# EAGLE design Gonies (EAGLE 9.6.2)
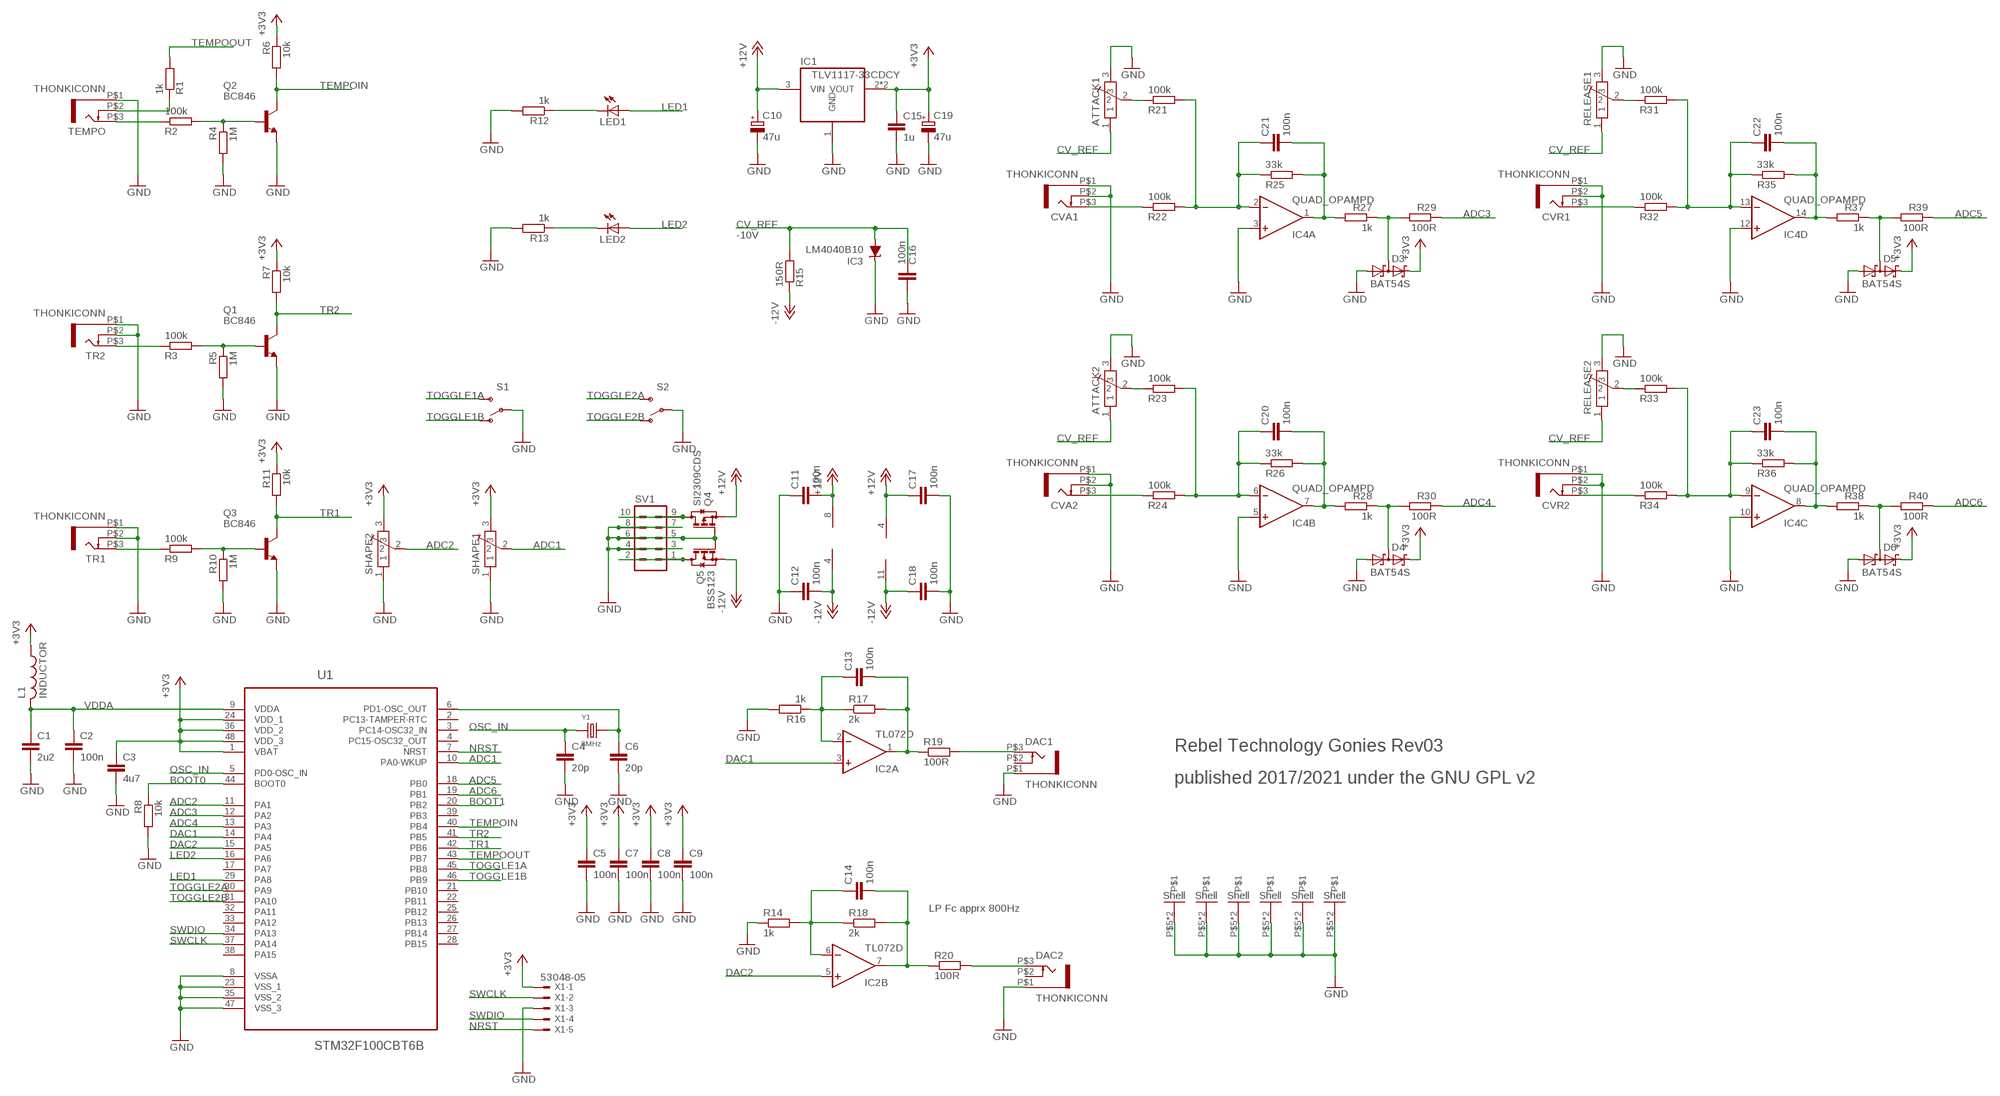
[diagram p0: schematic, sheet 1]

## Parts
ATTACK1  POT-ALPS-RK09L1140  [POT-ALPS-RK09L1140]
ATTACK2  POT-ALPS-RK09L1140  [POT-ALPS-RK09L1140]
C1  2u2  C-EUC0603  [C0603]
C2  100n  C-EUC0603  [C0603]
C3  4u7  C-EUC0603  [C0603]
C4  20p  C-EUC0603  [C0603]
C5  100n  C-EUC0603  [C0603]
C6  20p  C-EUC0603  [C0603]
C7  100n  C-EUC0603  [C0603]
C8  100n  C-EUC0603  [C0603]
C9  100n  C-EUC0603  [C0603]
C10  47u  CPOL-EU153CLV-0505  [CPOL-5]
C11  100n  C-EUC0603  [C0603]
C12  100n  C-EUC0603  [C0603]
C13  100n  C-EUC0603  [C0603]
C14  100n  C-EUC0603  [C0603]
C15  1u  C-EUC0603  [C0603]
C16  100n  C-EUC0603  [C0603]
C17  100n  C-EUC0603  [C0603]
C18  100n  C-EUC0603  [C0603]
C19  47u  CPOL-EU153CLV-0505  [CPOL-5]
C20  100n  C-EUC0603  [C0603]
C21  100n  C-EUC0603  [C0603]
C22  100n  C-EUC0603  [C0603]
C23  100n  C-EUC0603  [C0603]
CVA1  THONKICONN  [THONKICONN]
CVA2  THONKICONN  [THONKICONN]
CVR1  THONKICONN  [THONKICONN]
CVR2  THONKICONN  [THONKICONN]
D3  BAT54S  [SOT23]
D4  BAT54S  [SOT23]
D5  BAT54S  [SOT23]
D6  BAT54S  [SOT23]
DAC1  THONKICONN  [THONKICONN]
DAC2  THONKICONN  [THONKICONN]
IC1  TLV1117-33CDCY  REG1117  [SOT223]
IC2  TL072D  [SO08]
IC3  LM4040B10  LM4041C12DBZ  [DBZ_R-PDSO-G3]
IC4  QUAD_OPAMPD  [SO14]
L1  INDUCTOR  [0603]
LED1  LED3MM  [LED3MM]
LED2  LED3MM  [LED3MM]
Q1  BC846  [SOT23]
Q2  BC846  [SOT23]
Q3  BC846  [SOT23]
Q4  SI2309CDS  BSS84  [SOT23]
Q5  BSS123  [SOT23]
R1  1k  R-EU_0603  [0603]
R2  100k  R-EU_0603  [0603]
R3  100k  R-EU_0603  [0603]
R4  1M  R-EU_0603  [0603]
R5  1M  R-EU_0603  [0603]
R6  10k  R-EU_0603  [0603]
R7  10k  R-EU_0603  [0603]
R8  10k  R-EU_0603  [0603]
R9  100k  R-EU_0603  [0603]
R10  1M  R-EU_0603  [0603]
R11  10k  R-EU_0603  [0603]
R12  1k  R-EU_0603  [0603]
R13  1k  R-EU_0603  [0603]
R14  1k  R-EU_0603  [0603]
R15  150R  R-EU_0603  [0603]
R16  1k  R-EU_0603  [0603]
R17  2k  R-EU_0603  [0603]
R18  2k  R-EU_0603  [0603]
R19  100R  R-EU_0603  [0603]
R20  100R  R-EU_0603  [0603]
R21  100k  R-EU_0603  [0603]
R22  100k  R-EU_0603  [0603]
R23  100k  R-EU_0603  [0603]
R24  100k  R-EU_0603  [0603]
R25  33k  R-EU_0603  [0603]
R26  33k  R-EU_0603  [0603]
R27  1k  R-EU_0603  [0603]
R28  1k  R-EU_0603  [0603]
R29  100R  R-EU_0603  [0603]
R30  100R  R-EU_0603  [0603]
R31  100k  R-EU_0603  [0603]
R32  100k  R-EU_0603  [0603]
R33  100k  R-EU_0603  [0603]
R34  100k  R-EU_0603  [0603]
R35  33k  R-EU_0603  [0603]
R36  33k  R-EU_0603  [0603]
R37  1k  R-EU_0603  [0603]
R38  1k  R-EU_0603  [0603]
R39  100R  R-EU_0603  [0603]
R40  100R  R-EU_0603  [0603]
RELEASE1  POT-ALPS-RK09L1140  [POT-ALPS-RK09L1140]
RELEASE2  POT-ALPS-RK09L1140  [POT-ALPS-RK09L1140]
S1  SWITCH-SPST  [SWITCH-SPDT-SALECOM-T8014]
S2  SWITCH-SPST  [SWITCH-SPDT-SALECOM-T8014]
SHAPE1  POT-ALPS-RK09L1140  [POT-ALPS-RK09L1140]
SHAPE2  POT-ALPS-RK09L1140  [POT-ALPS-RK09L1140]
SV1  MA05-2  [MA05-2]
TEMPO  THONKICONN  [THONKICONN]
TR1  THONKICONN  [THONKICONN]
TR2  THONKICONN  [THONKICONN]
U1  STM32F100CBT6B  [QFP50P900X900X160-48N]
X1  53048-05  [53048-05]
Y1  8MHz  SMD-CRYSTAL-8MHZ-20PF-20PPM(2P-5.0X3.2MM)  [X2-SMD-5.0X3.2X1.3MM]

## Nets
+3V3: C3.1 C5.1 C7.1 C8.1 C9.1 C15.1 C19.+ D3.2(C2) D4.2(C2) D5.2(C2) D6.2(C2) IC1.2(VOUT) IC1.4(VOUT) L1.1 R6.1 R7.1 R11.1 SHAPE1.3 SHAPE2.3 U1.1(VBAT) U1.24(VDD_1) U1.36(VDD_2) U1.48(VDD_3) X1.1
+12V: C10.+ C11.2 C17.1 IC1.3(VIN) IC2.8(P:V+) IC4.4(P:V+) Q4.2(S)
-12V: C12.2 C18.1 IC2.4(P:V-) IC4.11(P:V-) Q5.2(S) R15.1
ADC1: SHAPE1.2 U1.10(PA0-WKUP)
ADC2: SHAPE2.2 U1.11(PA1)
ADC3: R29.1 U1.12(PA2)
ADC4: R30.1 U1.13(PA3)
ADC5: R39.1 U1.18(PB0)
ADC6: R40.1 U1.19(PB1)
BOOT0: R8.1 U1.44(BOOT0)
BOOT1: U1.20(PB2)
CV_REF: ATTACK1.1 ATTACK2.1 C16.1 IC3.2(A) R15.2 RELEASE1.1 RELEASE2.1
DAC1: IC2.3(A:+IN) U1.14(PA4)
DAC2: IC2.5(B:+IN) U1.15(PA5)
GND: ATTACK1.3 ATTACK1.P$5 ATTACK1.P$6 ATTACK2.3 ATTACK2.P$5 ATTACK2.P$6 C1.2 C2.2 C3.2 C4.2 C5.2 C6.2 C7.2 C8.2 C9.2 C10.- C11.1 C12.1 C15.2 C16.2 C17.2 C18.2 C19.- CVA1.P$1 CVA1.P$2 CVA2.P$1 CVA2.P$2 CVR1.P$1 CVR1.P$2 CVR2.P$1 CVR2.P$2 D3.1(A1) D4.1(A1) D5.1(A1) D6.1(A1) DAC1.P$1 DAC2.P$1 IC1.1(GND) IC3.1(C) IC4.3(A:+IN) IC4.5(B:+IN) IC4.10(C:+IN) IC4.12(D:+IN) Q1.2(E) Q2.2(E) Q3.2(E) Q4.1(G) Q5.1(G) R4.2 R5.2 R8.2 R10.2 R12.2 R13.2 R14.1 R16.2 RELEASE1.3 RELEASE1.P$5 RELEASE1.P$6 RELEASE2.3 RELEASE2.P$5 RELEASE2.P$6 S1.2(P) S2.2(P) SHAPE1.1 SHAPE1.P$5 SHAPE1.P$6 SHAPE2.1 SHAPE2.P$5 SHAPE2.P$6 SV1.3 SV1.4 SV1.5 SV1.6 SV1.7 SV1.8 TEMPO.P$1 TR1.P$1 TR1.P$2 TR2.P$1 TR2.P$2 U1.8(VSSA) U1.23(VSS_1) U1.35(VSS_2) U1.47(VSS_3) X1.3
LED1: LED1.A U1.29(PA8)
LED2: LED2.A U1.16(PA6)
N$1: C6.1 U1.6(PD1-OSC_OUT) Y1.2
N$2: LED2.K(C) R13.1
N$3: C14.2 IC2.7(B:OUT) R18.2 R20.1
N$4: C14.1 IC2.6(B:-IN) R14.2 R18.1
N$6: Q4.3(D) SV1.9 SV1.10
N$7: C13.2 IC2.1(A:OUT) R17.2 R19.1
N$9: LED1.K(C) R12.1
N$10: Q1.1(B) R3.2 R5.1
N$11: Q2.1(B) R2.2 R4.1
N$12: R2.1 TEMPO.P$3
N$13: C13.1 IC2.2(A:-IN) R16.1 R17.1
N$14: R3.1 TR2.P$3
N$16: Q5.3(D) SV1.1 SV1.2
N$17: R1.1 TEMPO.P$2
N$19: CVA1.P$3 R22.1
N$20: C21.1 IC4.2(A:-IN) R21.2 R22.2 R25.1
N$21: ATTACK1.2 R21.1
N$22: C21.2 IC4.1(A:OUT) R25.2 R27.2
N$23: R9.1 TR1.P$3
N$24: D3.3(C1A2) R27.1 R29.2
N$25: CVA2.P$3 R24.1
N$26: C20.1 IC4.6(B:-IN) R23.2 R24.2 R26.1
N$27: Q3.1(B) R9.2 R10.1
N$28: ATTACK2.2 R23.1
N$30: C20.2 IC4.7(B:OUT) R26.2 R28.2
N$31: DAC1.P$3 R19.2
N$32: DAC2.P$3 R20.2
N$33: D4.3(C1A2) R28.1 R30.2
N$35: CVR1.P$3 R32.1
N$36: C22.1 IC4.13(D:-IN) R31.2 R32.2 R35.1
N$37: R31.1 RELEASE1.2
N$39: C22.2 IC4.14(D:OUT) R35.2 R37.2
N$40: D5.3(C1A2) R37.1 R39.2
N$41: CVR2.P$3 R34.1
N$42: C23.1 IC4.9(C:-IN) R33.2 R34.2 R36.1
N$43: R33.1 RELEASE2.2
N$44: C23.2 IC4.8(C:OUT) R36.2 R38.2
N$45: D6.3(C1A2) R38.1 R40.2
NRST: U1.7(NRST) X1.5
OSC_IN: C4.1 U1.5(PD0-OSC_IN) Y1.1
SWCLK: U1.37(PA14) X1.2
SWDIO: U1.34(PA13) X1.4
TEMPOIN: Q2.3(C) R6.2 U1.40(PB4)
TEMPOOUT: R1.2 U1.43(PB7)
TOGGLE1A: S1.3(S) U1.45(PB8)
TOGGLE1B: S1.1(O) U1.46(PB9)
TOGGLE2A: S2.3(S) U1.30(PA9)
TOGGLE2B: S2.1(O) U1.31(PA10)
TR1: Q3.3(C) R11.2 U1.42(PB6)
TR2: Q1.3(C) R7.2 U1.41(PB5)
VDDA: C1.1 C2.1 L1.2 U1.9(VDDA)
Unconnected: DAC1.P$2 DAC2.P$2 U1.2(PC13-TAMPER-RTC) U1.3(PC14-OSC32_IN) U1.4(PC15-OSC32_OUT) U1.17(PA7) U1.21(PB10) U1.22(PB11) U1.25(PB12) U1.26(PB13) U1.27(PB14) U1.28(PB15) U1.32(PA11) U1.33(PA12) U1.38(PA15) U1.39(PB3)

## Notes on the sheet
- -10V
- Rebel Technology Gonies Rev03
- published 2017/2021 under the GNU GPL v2
- LP Fc apprx 800Hz

## Library data of the parts
ATTACK1 ATTACK2 RELEASE1 RELEASE2 SHAPE1 SHAPE2 = Rebel:POT-ALPS-RK09L
C1-C9 C11-C18 C20-C23 = Rebel:C-EU: CAPACITOR, European symbol
C10 C19 = Rebel:CPOL-EU: POLARIZED CAPACITOR, European symbol; FARNELL: 882-3014
CVA1 CVA2 CVR1 CVR2 DAC1 DAC2 TEMPO TR1 TR2 = Rebel:THONKICONN
D3-D6 = diode:BAT54S: Schottky Diodes Pin connection corrected 2011-05-04 Source: Fairchild .. BAT54.pdf
IC1 = burr-brown:REG1117: 800mA and 1A Low Dropout (LDO) Positive Regulator 1.8V, 2.5V, 2.85V, 3.3V, 5V, and Adj; FARNELL: 149-4942; MPN: REG1117; OC_FARNELL: 1097566; OC_NEWARK: 14P6981
IC2 = linear:TL072: OP AMP
IC3 = texas:LM4041: PRECISION MICROPOWER SHUNT VOLTAGE REFERENCE Source: http://focus.ti.com/lit/ds/slcs146e/slcs146e.pdf; MF: TEXAS INSTRUMENT CONNECTORS; MPN: LM4041C12QDBZT; OC_FARNELL: 1771733; OC_NEWARK: 43K3376
IC4 = adafruit:QUAD_OPAMP: OP AMP Standard quad package
L1 = Rebel:INDUCTOR
LED1 LED2 = Rebel:LED: LED
Q1-Q3 = transistor:BC846: NPN TRANSISTOR
Q4 = transistor-small-signal:BSS84: P-CHANNEL MOS FET; OC_FARNELL: 1779264
Q5 = transistor-small-signal:BSS123: N-CHANNEL MOS FET; OC_FARNELL: 1843725
R1-R40 = Rebel:R-EU_: RESISTOR, European symbol
S1 S2 = Rebel:SWITCH-SPST: SPST Switch Simple slide switch. Spark Fun Electronics SKU : COM-00102
SV1 = con-lstb:MA05-2: PIN HEADER; OC_FARNELL: unknown; OC_NEWARK: unknown
U1 = Rebel:STM32F100CBT6B: ARM-based 32-bit MCU; MPN: STM32F100CBT6B; OC_FARNELL: 1838512; OC_NEWARK: 86R1308; PACKAGE: LQFP-48; SUPPLIER: STMircroelectronics
X1 = con-molex:53?-05: CONNECTOR wire to board 1.25 mm (.049 inch) pitch header; MF: MOLEX; MPN: 53048-0510; OC_FARNELL: 9732926; OC_NEWARK: 57H4722
Y1 = Seeed-OPL-crystal-osctllator:SMD-CRYSTAL-8MHZ-20PF-20PPM(2P-5.0X3.2MM): 306010004; MPN: 5032/2P; VALUE: 5032/2p

## Board
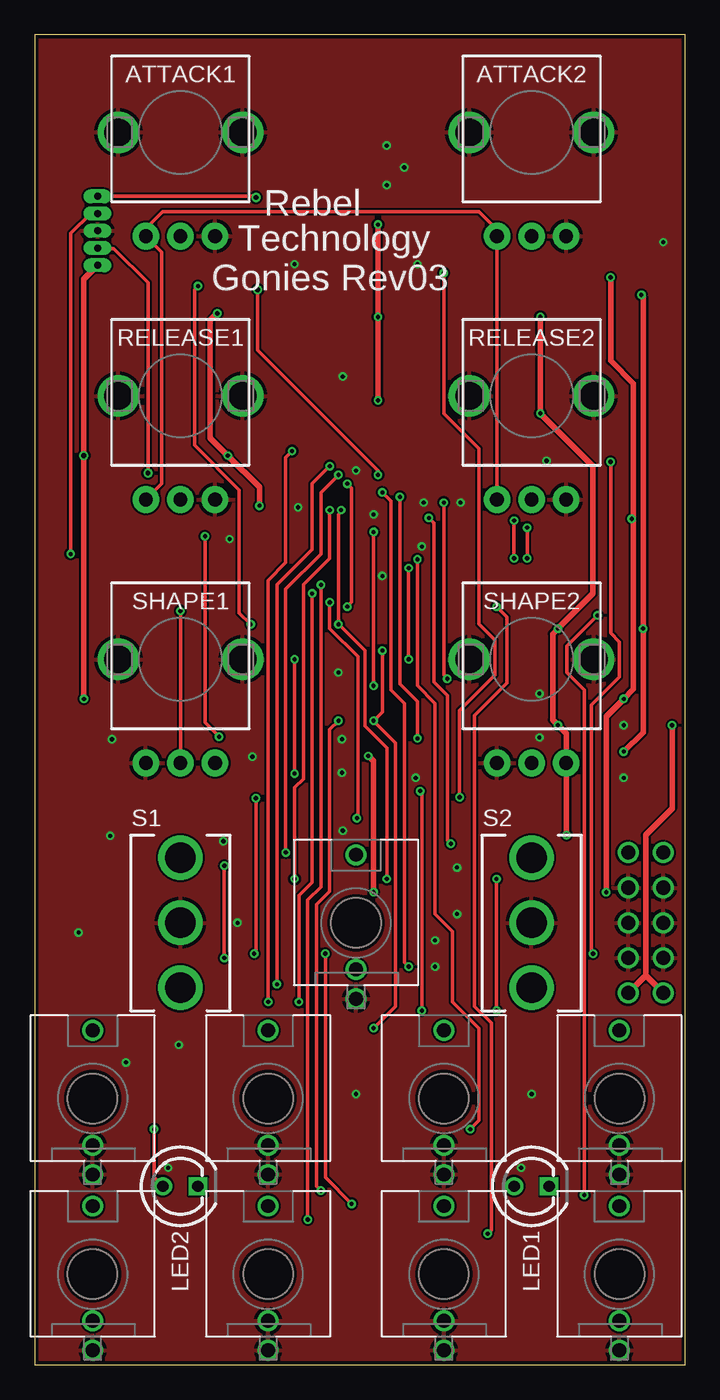
[diagram p1: board, top side]
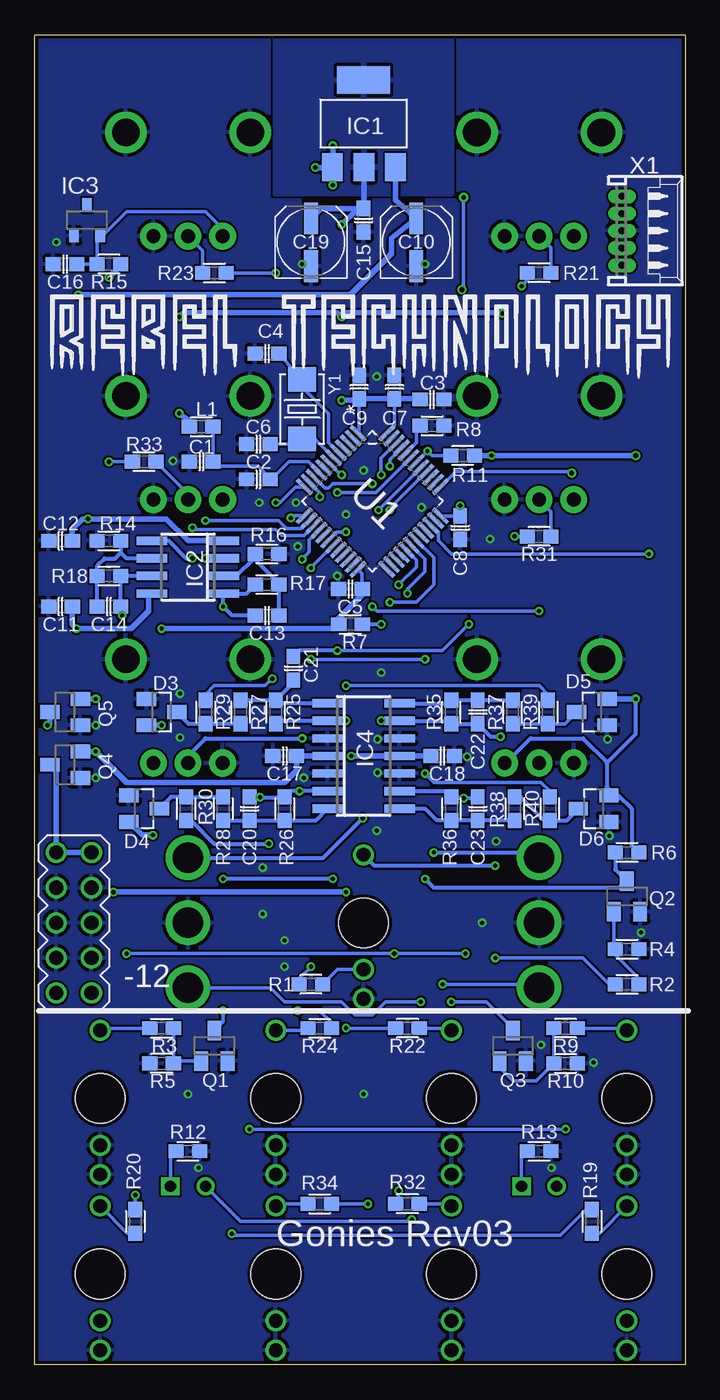
[diagram p2: board, bottom side, seen from below]

Size 47.05 x 96.19 mm. Coordinates in mm from the lower left corner, seen from the top.
Outline: 47.05,0 47.05,96.19 0,96.19 0,0 47.05,0
Copper layers (1*16): Top 0.035mm / dielectric 1.5mm / Bottom 0.035mm
Design rules "SeeedStudio_2layer_DRU_no_angle_20140221": minimum track width 6mil, minimum drill 12mil, track to track 6mil, track to pad 6mil, pad to pad 6mil, via to via 6mil, smd to smd 0mil, copper to edge 10mil, drill to drill 10mil, minimum pad ring 10mil, minimum via ring 6mil, stop-mask expansion 2mil, vias tented up to drill 100mil, thermal gap 10mil

### Footprints (pad centres in the part's own frame; a part is rotated, then mirrored left to right if it is on the bottom)
POT-ALPS-RK09L1140 = drill 1 pad 1.93: 1 -2.5,-7.5; 2 0,-7.5; 3 2.5,-7.5 | drill 2: P$5 -4.5,0; P$6 4.5,0
C0603 = smd 1.1 x 1: 1 -0.85,0; 2 0.85,0
CPOL-5 = smd 2.3 x 1: + 1.725,0; - -1.725,0
THONKICONN = drill 1: P$1 0,-5.5; P$2 0,-3.38; P$3 0,4.92 | hole 3.6: 0,0
SOT23 = smd 1 x 1.4: 1 -0.95,-1.1; 2 0.95,-1.1; 3 0,1.1
SOT223 = smd 1.499 x 2.007: 1 -2.261,-3.15; 2 0.025,-3.15; 3 2.311,-3.15 | smd 3.81 x 2.007: 4 0,3.15
SO08 = smd 0.6 x 2.2: 1 -1.905,-2.6; 2 -0.635,-2.6; 3 0.635,-2.6; 4 1.905,-2.6; 5 1.905,2.6; 6 0.635,2.6; 7 -0.635,2.6; 8 -1.905,2.6
DBZ_R-PDSO-G3 = smd 0.7 x 1: 1 -0.95,-1.1; 2 0.95,-1.1; 3 0,1.1
SO14 = smd 0.6 x 2.2: 1 -3.81,-2.6; 2 -2.54,-2.6; 3 -1.27,-2.6; 4 0,-2.6; 5 1.27,-2.6; 6 2.54,-2.6; 7 3.81,-2.6; 8 3.81,2.6; 9 2.54,2.6; 10 1.27,2.6; 11 0,2.6; 12 -1.27,2.6; 13 -2.54,2.6; 14 -3.81,2.6
0603 = smd 1.1 x 1: 1 -0.85,0; 2 0.85,0
LED3MM = drill 0.813: A -1.27,0 | drill 0.813 square: K 1.27,0
SWITCH-SPDT-SALECOM-T8014 = drill 2.2: 1 0,4.699; 2 0,0; 3 0,-4.699
MA05-2 = drill 1.016: 1 -5.08,-1.27; 2 -5.08,1.27; 3 -2.54,-1.27; 4 -2.54,1.27; 5 0,-1.27; 6 0,1.27; 7 2.54,-1.27; 8 2.54,1.27; 9 5.08,-1.27; 10 5.08,1.27
QFP50P900X900X160-48N = smd 1.473 x 0.279: 1 -4.216,2.743; 2 -4.216,2.261; 3 -4.216,1.753; 4 -4.216,1.245; 5 -4.216,0.762; 6 -4.216,0.254; 7 -4.216,-0.254; 8 -4.216,-0.762; 9 -4.216,-1.245; 10 -4.216,-1.753; 11 -4.216,-2.261; 12 -4.216,-2.743; 25 4.216,-2.743; 26 4.216,-2.261; 27 4.216,-1.753; 28 4.216,-1.245; 29 4.216,-0.762; 30 4.216,-0.254; 31 4.216,0.254; 32 4.216,0.762; 33 4.216,1.245; 34 4.216,1.753; 35 4.216,2.261; 36 4.216,2.743 | smd 0.279 x 1.473: 13 -2.743,-4.216; 14 -2.261,-4.216; 15 -1.753,-4.216; 16 -1.245,-4.216; 17 -0.762,-4.216; 18 -0.254,-4.216; 19 0.254,-4.216; 20 0.762,-4.216; 21 1.245,-4.216; 22 1.753,-4.216; 23 2.261,-4.216; 24 2.743,-4.216; 37 2.743,4.216; 38 2.261,4.216; 39 1.753,4.216; 40 1.245,4.216; 41 0.762,4.216; 42 0.254,4.216; 43 -0.254,4.216; 44 -0.762,4.216; 45 -1.245,4.216; 46 -1.753,4.216; 47 -2.261,4.216; 48 -2.743,4.216
53048-05 = drill 0.5 pad 0.698 long: 1 2.5,-1.25; 2 1.25,-1.25; 3 0,-1.25; 4 -1.25,-1.25; 5 -2.5,-1.25
X2-SMD-5.0X3.2X1.3MM = smd 1.778 x 2.032: 1 -2.159,0; 2 2.159,0

### Placement (x,y rotation side)
ATTACK1  10.55,89.12 0 top
ATTACK2  35.95,89.12 0 top
C1  35,65.3 180 bottom
C2  30.87,64.03 180 bottom
C3  18.3,69.81 0 bottom
C4  30.23,73.11 180 bottom
C5  24.2,56.1 180 bottom
C6  30.87,66.57 180 bottom
C7  21.03,70.7 90 bottom
C8  16.27,60.54 270 bottom
C9  23.57,70.7 90 bottom
C10  19.44,81.18 90 bottom
C11  45.16,54.83 0 bottom
C12  45.16,59.59 0 bottom
C13  30.23,54.19 180 bottom
C14  41.66,54.83 0 bottom
C15  23.25,82.77 270 bottom
C16  44.84,79.59 180 bottom
C17  28.96,44.03 180 bottom
C18  17.54,44.03 0 bottom
C19  27.06,81.18 90 bottom
C20  31.51,40.22 270 bottom
C21  28.33,50.38 270 bottom
C22  14.99,47.21 90 bottom
C23  14.99,40.22 270 bottom
CVA1  16.9,19.27 0 top
CVA2  29.6,19.27 0 top
CVR1  16.9,6.57 0 top
CVR2  29.6,6.57 0 top
D3  37.86,47.21 270 bottom
D4  39.12,40.22 270 bottom
D5  6.74,47.21 90 bottom
D6  6.61,40.22 90 bottom
DAC1  4.2,6.57 0 top
DAC2  42.3,6.57 0 top
IC1  23.25,89.75 0 bottom
IC2  35.95,57.68 90 bottom
IC3  43.25,82.77 0 bottom
IC4  23.25,44.03 270 bottom
L1  35,67.84 0 bottom
LED1  35.95,12.92 0 top
LED2  10.55,12.92 0 top
Q1  34.05,23.08 0 bottom
Q2  4.2,33.87 0 bottom
Q3  12.46,23.08 0 bottom
Q4  44.84,43.4 90 bottom
Q5  44.84,47.21 90 bottom
R1  27.06,27.52 180 bottom
R2  4.2,27.52 0 bottom
R3  37.86,24.35 0 bottom
R4  4.2,30.06 0 bottom
R5  37.86,21.81 180 bottom
R6  4.2,37.05 180 bottom
R7  24.2,53.56 0 bottom
R8  18.3,67.91 0 bottom
R9  8.64,24.35 180 bottom
R10  8.64,21.81 0 bottom
R11  16.07,65.75 180 bottom
R12  35.95,15.46 0 bottom
R13  10.55,15.46 0 bottom
R14  41.66,59.59 0 bottom
R15  41.66,79.59 180 bottom
R16  30.23,58.64 0 bottom
R17  30.23,56.41 180 bottom
R18  41.66,57.05 0 bottom
R19  6.74,10.38 270 bottom
R20  39.76,10.38 270 bottom
R21  10.55,78.96 180 bottom
R22  20.08,24.35 180 bottom
R23  34.05,78.96 0 bottom
R24  26.43,24.35 0 bottom
R25  29.6,47.21 90 bottom
R26  28.96,40.22 270 bottom
R27  32.14,47.21 90 bottom
R28  33.41,40.22 270 bottom
R29  34.68,47.21 270 bottom
R30  36.08,40.22 90 bottom
R31  10.55,59.91 180 bottom
R32  20.08,11.65 180 bottom
R33  39.12,65.3 180 bottom
R34  26.43,11.65 0 bottom
R35  16.9,47.21 90 bottom
R36  16.9,40.22 270 bottom
R37  12.46,47.21 90 bottom
R38  12.33,40.22 270 bottom
R39  9.91,47.21 270 bottom
R40  9.79,40.22 270 bottom
RELEASE1  10.55,70.07 0 top
RELEASE2  35.95,70.07 0 top
S1  10.55,31.97 0 top
S2  35.95,31.97 0 top
SHAPE1  10.55,51.02 0 top
SHAPE2  35.95,51.02 0 top
SV1  44.2,31.97 90 bottom
TEMPO  23.25,31.97 0 top
TR1  4.2,19.27 0 top
TR2  42.3,19.27 0 top
U1  22.62,62.45 315 bottom
X1  3.31,82 270 bottom
Y1  27.7,69.11 270 bottom

### Tracks (layer width: path | path; a pad name or v marks a point on that pad's centre or on a via)
+3V3  (via drill 0.3, 0.35)
  Top 0.406: v24.84,69.75 v24.84,75.78 v24.84,82.45 | v36.59,75.78 v36.59,68.8 40.4,64.99 40.4,55.78 v37.86,53.24 37.47,52.86 37.47,46.63 v37.86,46.25 38.45,45.66 SHAPE2.3 38.45,38.36 v38.49,38.32 | v3.56,48.16 v3.56,65.75 3.56,78.51 X1.1 | v13.22,76.03 12.71,75.53 12.71,67.02 v13.98,65.75 16.27,63.46 v16.27,62.13
  Bottom 0.254: C9.1 23.57,67.46 U1.1 | C7.1 21.03,67.91 U1.48 | C5.1 23.35,57.22 U1.24 | C8.1 17.68,61.39 U1.36
  Bottom 0.305: SHAPE1.3 12.97,43.52 11.19,45.3 7.38,45.3 5.63,43.55 | R6.1 3.86,37.55 3.86,40.22 4.81,41.17 | 5.63,43.55 5.66,43.52 5.66,41.8 4.81,40.95 4.81,41.17 | 5.63,43.55 3.56,45.62 v3.56,48.16 | D6.2 4.81,41.17
  Bottom 0.406: IC1.2 23.23,83.96 C15.1 | C19.+ 26.35,83.62 C15.1 | C3.1 19.19,69.85 C7.1 C9.1 23.67,69.75 v24.84,69.75 | v24.84,82.45 23.67,83.62 C15.1 | v36.59,75.78 36.27,76.1 25.16,76.1 v24.84,75.78 24.52,76.1 13.28,76.1 v13.22,76.03 | v37.86,53.24 25.47,53.24 25.16,53.56 | v37.86,46.25 D3.2 | C5.1 23.35,55.68 25.16,53.87 25.16,53.56 | v38.49,38.32 39.27,38.32 D4.2 | L1.1 35.85,68.26 v36.59,68.8 | R7.1 25.16,53.56 | v16.27,62.13 C8.1 | R11.1 v13.98,65.75 v3.56,65.75 | v3.56,48.16 D5.2
  pour Bottom: 16.9,96.1 16.9,84.67 29.6,84.67 29.6,96.1
+12V  (via drill 0.3)
  Top 0.406: v42.62,44.35 44.01,45.75 v44.01,53.24 44.01,77.24 v43.89,77.37
  Bottom 0.254: IC2.8 38.81,55.78
  Bottom 0.406: IC1.3 20.94,84.22 C10.+ 21.22,81.45 21.22,80.35 24.2,77.37 v43.89,77.37 | 38.81,55.78 38.81,54.51 40.08,53.24 v44.01,53.24 44.31,53.53 C11.2 | IC4.4 C17.1 28.12,42.98 28.96,42.13 40.4,42.13 v42.62,44.35 Q4.2
-12V  (via drill 0.3)
  Top 0.406: v24.14,44.03 24.52,43.65 v24.52,34.19 | v41.35,34.19 41.35,46.89 v42.62,48.16 43.32,48.86 43.32,61.05 v43.19,61.18 43.32,61.3 43.32,70.95 41.66,72.61 v41.66,78.64
  Bottom 0.305: Q5.2 43.25,48.16
  Bottom 0.406: C18.1 IC4.11 v24.14,44.03 | v24.52,34.19 v41.35,34.19 | IC2.4 35.95,59.59 37.54,61.18 v43.19,61.18 43.57,61.18 44.31,60.44 C12.2 | R15.1 40.82,79.49 v41.66,78.64 | 43.25,48.16 v42.62,48.16
ADC1  (via drill 0.3)
  Top 0.254: SHAPE1.2 v10.55,54.51 | v22.62,54.83 22.93,55.14 22.93,63.4 v22.62,63.72
  Bottom 0.254: v10.55,54.51 22.3,54.51 v22.62,54.83 | v22.62,63.72 25.47,63.72 25.79,63.4 26.05,63.4 U1.10
ADC2  (via drill 0.3)
  Top 0.254: v26.43,62.76 26.43,49.23 27.7,47.96 v27.7,45.3
  Bottom 0.254: v26.43,62.76 26.45,63.08 U1.11 | SHAPE2.2 35.95,44.03
  Bottom 0.305: 35.95,44.03 34.68,45.3 v27.7,45.3
ADC3  (via drill 0.3)
  Top 0.254: v29.6,62.35 29.6,49.87 v29.85,49.62
  Bottom 0.254: R29.1 34.68,48.48 34.05,49.11 30.36,49.11 v29.85,49.62 | v29.6,62.35 29.31,62.35 28.17,63.49 U1.12
ADC4  (via drill 0.3)
  Top 0.254: v30.11,37.68 29.85,37.94 29.85,48.41 28.9,49.37 28.9,60.86 v28.52,61.24
  Bottom 0.254: U1.13 28.36,61.4 v28.52,61.24 | R30.1 35.73,39.37
  Bottom 0.305: 35.73,39.37 34.05,37.68 v30.11,37.68
ADC5  (via drill 0.3)
  Top 0.254: v24.52,49.11 v24.52,60.22
  Bottom 0.254: v24.52,60.22 25.2,60.22 U1.18 | R39.1 9.91,48.48 10.55,49.11 v24.52,49.11
ADC6  (via drill 0.3)
  Top 0.254: v18.8,42.76 v18.8,51.02 | v27.06,51.02 v27.06,57.62
  Bottom 0.254: R40.1 9.79,41.49 10.42,42.13 18.17,42.13 v18.8,42.76 | v18.8,51.02 v27.06,51.02 | v27.06,57.62 27.06,57.64 U1.19
BOOT0
  Bottom 0.254: U1.44 19.44,66.7 19.44,67.61 R8.1
CV_REF
  Top 0.254: RELEASE1.1 9.19,63.71 9.19,80.47 ATTACK1.1 8.05,82.17 9.28,83.4 32.14,83.4 33.45,82.09 ATTACK2.1 RELEASE2.1
  Bottom 0.254: C16.1 R15.2 42.52,81.45 IC3.2 42.13,81.67 40.4,83.4 34.68,83.4 33.45,82.17 ATTACK2.1
DAC1  (via drill 0.3)
  Top 0.254: v34.68,58.32 v34.68,61.05
  Bottom 0.254: v34.68,61.05 29.41,61.05 28.84,60.48 27.78,60.48 U1.14
  Bottom 0.305: IC2.3 v34.68,58.32
DAC2  (via drill 0.3)
  Top 0.254: v35.63,60.54 v35.63,58.32
  Bottom 0.254: U1.15 27.57,59.97 29.16,59.97 29.6,60.41 35.51,60.41 v35.63,60.54
  Bottom 0.305: IC2.5 37.35,59.59 36.08,58.32 v35.63,58.32
GND  (via drill 0.3)
  Bottom 0.406: IC1.1 25.47,86.6 | 25.47,86.6 25.47,86.58 | 25.47,86.58 v25.47,85.31 | v26.74,86.58 25.47,86.58 | 25.47,86.6 v25.47,88.16
  other vias: 22.3,38.63 21.98,50.06 24.52,61.49 23.25,64.67 22.3,71.46 18.8,79.59 27.7,79.59 23.25,19.58 35.95,19.58 9.66,14.25 13.66,37.87 14.68,31.97 30.55,32.6 28.96,30.7 28.96,28.79 45.48,81.18 42.62,46.25 42.62,42.44 22.23,42.82 27.57,42.44 22.23,45.24 15.76,43.97 5.6,45.24 5.47,38.25 3.18,31.27 6.61,21.87 10.42,23.14 35.19,14.25 30.55,35.97 36.52,45.36 36.52,48.54 30.81,62.35 19.06,62 25.16,57.05 37.03,65.37 14.11,59.72 28.14,62.35 28.01,59.18
  pour Bottom (rank 2): 50.55,-4.86 -1.51,-4.86 -1.51,96.1 50.55,96.1
  pour Top: 48.65,-4.86 -2.79,-4.86 -2.79,96.1 48.65,96.1
LED1  (via drill 0.3)
  Top 0.254: v19.76,10.5 19.76,33.62 20.71,34.57 v20.71,56.41
  Bottom 0.254: v20.71,56.41 19.44,57.68 19.44,58.19 U1.29 | LED1.A 32.14,10.38 19.89,10.38 v19.76,10.5
LED2  (via drill 0.3)
  Top 0.254: v27.7,58.26 27.7,49.11 28.96,47.84 28.96,32.6 30.23,31.33 30.23,26.25 32.14,24.35 32.14,17.68 v31.51,17.04 | v8.64,17.04 8.64,13.55 LED2.A
  Bottom 0.254: v31.51,17.04 v8.64,17.04 | v27.7,58.26 27.19,58.76 27.19,59.63 U1.16
N$1
  Bottom 0.254: U1.6 26.76,66.95 Y1.2 27.95,66.57 C6.1
N$2
  Bottom 0.254: LED2.K 11.82,15.04 R13.1
N$3  (via drill 0.3)
  Top 0.254: v39.76,12.28 39.76,48.79 38.49,50.06 38.49,51.97 v40.71,54.19
  Bottom 0.254: v40.71,54.19 40.71,54.72 C14.2 | R20.1 v39.76,12.28
  Bottom 0.305: IC2.7 R18.2 C14.2
N$4
  Bottom 0.305: IC2.6 40.4,58.32 40.82,58.74 | C14.1 R18.1 42.52,57.79 41.98,58.32 41.23,58.32 40.82,58.74 | R14.2 40.82,58.74
N$6
  Bottom 0.406: SV1.9 SV1.10 45.48,42.93 Q4.3
N$7  (via drill 0.3)
  Top 0.254: v32.77,9.49 33.03,9.74 33.03,24.73 31.82,25.93 31.82,46.95 34.17,49.3 34.17,54.06 v33.41,54.83
  Bottom 0.254: R19.1 7.16,11.23 9.03,9.36 32.65,9.36 v32.77,9.49 | 33.41,55.72 IC2.1
  Bottom 0.305: 33.41,55.72 v33.41,54.83 32.77,54.19 C13.2 | IC2.1 31.72,55.78 R17.2
N$9
  Bottom 0.254: LED1.K 37.22,15.04 R12.1
N$10
  Bottom 0.254: Q1.1 36.84,21.98 R5.1 R3.2
N$11
  Bottom 0.254: R2.2 3.35,27.94 5.05,29.64 R4.1 5.15,30.16 Q2.1
N$12  (via drill 0.3)
  Top 0.254: v13.72,29.43 v13.72,36.09
  Bottom 0.254: R2.1 5.47,27.52 7.38,29.43 v13.72,29.43
  Bottom 0.305: v13.72,36.09 22.46,36.09 TEMPO.P$3
N$13
  Bottom 0.254: IC2.2 32.46,57.05 | 31.19,58.32 31.09,58.42 R16.1 | R17.1 29.39,56.52
  Bottom 0.305: R17.1 C13.1 | 32.46,57.05 31.19,58.32 29.39,56.52
N$14
  Bottom 0.254: R3.1 42.14,24.35 TR2.P$3
N$16  (via drill 0.3)
  Top 0.406: v46.11,46.25 46.11,40.22 44.2,38.32 44.2,28.16 | 44.2,28.16 SV1.1 | SV1.2 44.2,28.16
  Bottom 0.406: Q5.3 45.94,46.42 v46.11,46.25
N$17
  Bottom 0.254: TEMPO.P$2 25.15,28.59 R1.1
N$19
  Bottom 0.254: R22.1 17.06,24.35 CVA1.P$3
N$20  (via drill 0.3)
  Top 0.254: v24.52,24.35 26.11,25.93 26.11,44.98 v24.52,46.57 25.16,47.21 v25.16,51.65 | v11.82,78 11.57,77.75 11.57,66.51 14.8,63.27 14.8,54.38 v15.63,53.56
  Bottom 0.254: 29.39,46.57 R25.1 | R22.2 v24.52,24.35 | v24.52,46.57 IC4.2 | R21.2 11.4,78.42 v11.82,78 | v15.63,53.56 17.54,51.65 v25.16,51.65
  Bottom 0.305: IC4.2 29.39,46.57 | v25.16,51.65 27.91,51.65 C21.1
N$21
  Bottom 0.254: R21.1 9.7,80.77 ATTACK1.2
N$22
  Bottom 0.254: 29.39,47.84 R25.2
  Bottom 0.305: IC4.1 29.39,47.84 | R27.2 R25.2 28.33,49.33 C21.2
N$23
  Bottom 0.254: R9.1 4.36,24.35 TR1.P$3
N$24
  Bottom 0.305: R27.1 R29.2 35.91,46.36 D3.3
N$25
  Bottom 0.254: CVA2.P$3 27.44,24.19 R24.1
N$26  (via drill 0.3)
  Top 0.254: v27.89,41.49 28.01,41.36 v28.01,25.62 | v30.74,41.05 30.74,47.33 33.28,49.87 33.28,52.41 32.14,53.56 32.14,66.26 29.6,68.8 v29.6,78.96
  Bottom 0.254: 28.55,41.49 R26.1 | R24.2 25.58,24.77 26.43,25.62 v28.01,25.62 | v29.6,78.96 R23.2
  Bottom 0.305: IC4.6 v27.89,41.49 28.55,41.49 | R26.1 28.99,41.05 v30.74,41.05 30.77,41.07 C20.1
N$27
  Bottom 0.254: R9.2 R10.1 10.76,20.54 12.46,20.54 13.4,21.49 Q3.1
N$28
  Bottom 0.254: ATTACK2.2 34.9,80.56 R23.1
N$30
  Bottom 0.305: IC4.7 26.7,39.37 R26.2 C20.2 R28.2
N$31
  Bottom 0.254: R19.2 6.16,9.53 DAC1.P$3
N$32
  Bottom 0.254: R20.2 40.34,9.53 DAC2.P$3
N$33
  Bottom 0.305: D4.3 37.18,41.07 R30.2 R28.1
N$35
  Bottom 0.254: R32.1 17.06,11.65 CVR1.P$3
N$36  (via drill 0.3)
  Top 0.254: v20.71,12.6 20.39,12.92 20.39,33.3 21.35,34.25 21.35,45.94 v21.98,46.57 | v12.33,59.91 12.33,46.44 v13.34,45.43
  Bottom 0.254: 17.12,46.57 R35.1 | v21.98,46.57 IC4.13 | v12.33,59.91 R31.2 | v20.71,12.6 20.71,11.75 R32.2
  Bottom 0.305: IC4.13 17.12,46.57 | R35.1 C22.1 14.07,45.43 v13.34,45.43
N$37
  Bottom 0.254: R31.1 9.7,61.72 RELEASE1.2
N$39
  Bottom 0.254: 17.12,47.84 R35.2
  Bottom 0.305: IC4.14 17.12,47.84 | R37.2 C22.2 R35.2
N$40
  Bottom 0.254: R37.1 R39.2 8.69,46.36 D5.3
N$41
  Bottom 0.254: R34.1 29.44,11.65 CVR2.P$3
N$42  (via drill 0.3)
  Top 0.254: v41.66,65.3 41.66,52.92 42.3,52.29 42.3,49.75 40.27,47.71 40.27,29.87 v40.4,29.74 | v15.88,29.74 16.01,29.87 v16.01,40.98 | v22.93,11.65 21.03,13.55 v21.03,29.74
  Bottom 0.254: R33.2 v41.66,65.3 | v40.4,29.74 v21.03,29.74 v15.88,29.74 | 16.81,40.98 R36.1 | R34.2 v22.93,11.65
  Bottom 0.305: IC4.9 17.32,41.49 R36.1 | 16.81,40.98 v16.01,40.98 15.08,40.98 C23.1
N$43
  Bottom 0.254: RELEASE2.2 35.95,62.98 R33.1
N$44
  Bottom 0.305: IC4.8 18.8,40.22 17.96,39.37 R36.2 C23.2 R38.2
N$45
  Bottom 0.254: R38.1 11.91,41.07 | R40.2 10.21,39.37
  Bottom 0.305: 10.21,39.37 11.91,41.07 | R40.2 8.56,39.37 D6.3
NRST  (via drill 0.3, 0.35)
  Top 0.254: v24.84,64.35 24.84,64.67 16.14,73.37 v16.14,77.75 | X1.5 15.92,84.5 v16.01,84.42
  Bottom 0.254: v24.84,64.35 24.88,64.35 U1.7 | v16.01,84.42 16.01,77.88 v16.14,77.75
OSC_IN
  Bottom 0.254: U1.5 25.79,66.7 25.79,68.8 28.27,71.27 Y1.1 C4.1
SWCLK  (via drill 0.35)
  Top 0.254: v8.2,64.48 8.2,78.24 5.71,80.72 4.59,80.72 X1.2
  Bottom 0.254: v8.2,64.48 8.33,64.6 16.58,64.6 U1.37
SWDIO  (via drill 0.3)
  Top 0.254: v2.61,58.64 2.61,81.81 4.05,83.25 X1.4
  Bottom 0.254: U1.34 18.33,60.7 17.85,60.22 17.85,59.59 16.9,58.64 v2.61,58.64
TEMPOIN  (via drill 0.3)
  Top 0.254: v18.8,35.14 18.8,41.75 19.44,42.38 19.44,56.41 21.35,58.32 v21.35,61.81
  Bottom 0.254: v21.35,61.81 21.35,61.96 U1.40 | Q2.3 4.37,34.97 4.84,34.51
  Bottom 0.305: R6.2 5.05,35.82 Q2.3 | 4.84,34.51 18.17,34.51 v18.8,35.14
TEMPOOUT  (via drill 0.3)
  Top 0.254: v25.16,63.08 25.79,62.45 25.79,48.79 26.74,47.84 26.74,29.11 v27.06,28.79
  Bottom 0.254: R1.2 27.91,27.94 v27.06,28.79 | v25.16,63.08 22.34,63.08 U1.43
TOGGLE1A  (via drill 0.3)
  Top 0.254: v21.35,64.99 20.08,63.72 20.08,58.95 17.54,56.41 v17.54,27.52
  Bottom 0.254: v21.35,64.99 21.35,65.48 U1.45 | v17.54,27.52 10.8,27.52 S1.3
TOGGLE1B  (via drill 0.3)
  Top 0.254: v21.98,64.35 20.71,63.08 20.71,58.64 18.17,56.1 v18.17,37.05
  Bottom 0.254: v21.98,64.35 21.98,65.56 U1.46
  Bottom 0.305: v18.17,37.05 10.93,37.05 S1.1
TOGGLE2A  (via drill 0.3)
  Top 0.254: v19.12,26.25 19.12,33.93 20.08,34.89 v20.08,55.78
  Bottom 0.254: v20.08,55.78 20.08,56.1 18.8,57.37 18.8,58.28 U1.30 | S2.3 29.98,27.27 28.96,26.25 24.84,26.25 23.89,25.3 22.62,25.3 21.66,26.25 v19.12,26.25
TOGGLE2B  (via drill 0.3)
  Top 0.254: v23.31,39.52 23.38,39.59 23.38,51.21 21.35,53.24 v21.35,55.14
  Bottom 0.254: v21.35,55.14 19.44,55.14 18.17,56.41 18.17,58.36 U1.31
  Bottom 0.305: S2.1 26.17,36.67 v23.31,39.52
TR1  (via drill 0.3)
  Top 0.254: v16.9,26.25 16.9,56.73 18.17,58 18.17,65.62 v18.62,66.08
  Bottom 0.254: R11.2 18.3,65.75 v18.62,66.08 U1.42 | Q3.3 12.46,24.35 14.36,26.25 v16.9,26.25
TR2  (via drill 0.3)
  Top 0.254: v22.17,61.81 22.17,61.69 21.98,61.49 v21.98,53.56 23.89,51.65 23.89,46.19 25.47,44.6 v25.47,35.14 | v33.41,35.14 v33.41,25.62
  Bottom 0.254: v22.17,61.81 U1.41 | v33.41,25.62 33.41,24.81 Q1.3
  Bottom 0.305: v25.47,35.14 v33.41,35.14 | R7.2 v21.98,53.56
VDDA
  Bottom 0.254: U1.9 27.23,65.3 28.65,65.3 29.92,64.03 C2.1 30.02,64.14 30.87,64.99 33.83,64.99 C1.1 L1.2

### Text on the board
tPlace: Rebel | Technology | Gonies Rev03
bPlace: -12 | Gonies Rev03